# Altium schematic sheet endstop.SchDoc
size A
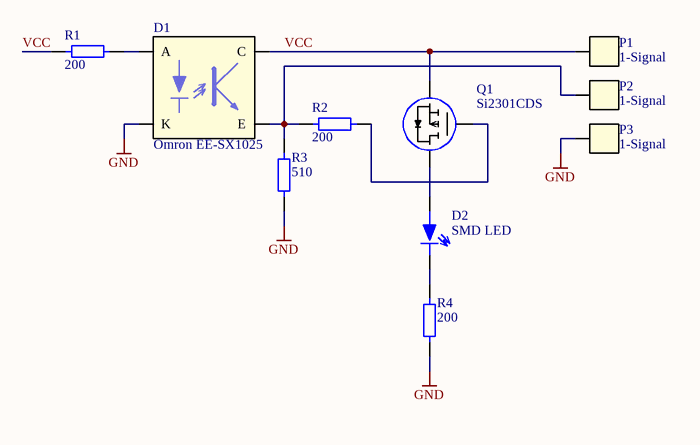
[diagram p0: endstop.SchDoc]

## Parts
D1  Omron EE-SX1025  [EE-SX1025]
D2  SMD LED  [0603]
P1  1-Signal  [1-SignalSmall]
P2  1-Signal  [1-SignalSmall]
P3  1-Signal  [1-SignalSmall]
Q1  Si2301CDS  [SOT23-3]
R1  200  [0402]
R2  200  [0402]
R3  510  [0402]
R4  200  [0402]

## Nets
GND: D1.2(K) P3.1 R3.1 R4.1
VCC: D1.3(C) P1.1 Q1.2(S) R1.1
NetD1_1: D1.1(A) R1.2
NetD1_4: D1.4(E) P2.1 R2.1 R3.2
NetD2_1: D2.1(A) Q1.3(D)
NetD2_2: D2.2(K) R4.2
NetQ1_1: Q1.1(G) R2.2

## Library data of the parts
D1 = EE-SX1025
R1-R4 = Res